# EAGLE design inverter_interface (EAGLE 8.5.1)

## Sheet 1 of 5: power interface
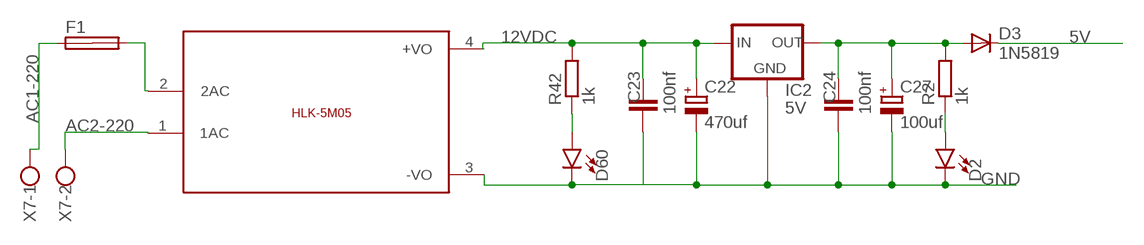
[diagram p0: schematic, sheet 1]

### Parts
C22  470uf  CPOL-EUE3.5-8  [E3,5-8]
C23  100nf  C-EU050-030X075  [C050-030X075]
C24  100nf  C-EU050-030X075  [C050-030X075]
C27  100uf  CPOL-EUE3.5-8  [E3,5-8]
D2  LED5MM  [LED_5MM]
D3  1N5819  1N4004  [DO41-10]
D60  LED5MM  [LED_5MM]
F1  SHK20Q  [SHK20Q]
IC2  5V  V_REG_78XXSIDE  [78XXL]
R2  1k  R-EU_0207/10  [0207/10]
R42  1k  R-EU_0207/10  [0207/10]
U$3  5VDC/5W  HLK-5M05  [HLK-5M05]
X7  W237-102  [W237-102]

### Nets
5V: D3.C ; also sheet 2,3
12VDC: C22.+ C23.2 IC2.IN R42.2 U$3.4(+VO) ; also sheet 4
AC1-220: F1.1A X7.1
AC2-220: U$3.1(1AC) X7.2
GND: C22.- C23.1 C24.1 C27.- D2.K(C) D60.K(C) IC2.GND U$3.3(-VO) ; also sheet 2,3,4,5
N$2: D2.A R2.1
N$5: C24.2 C27.+ D3.A IC2.OUT R2.2
N$6: F1.2A U$3.2(2AC)
N$74: D60.A R42.1
Unconnected: F1.1B F1.2B

## Sheet 2 of 5: MCU
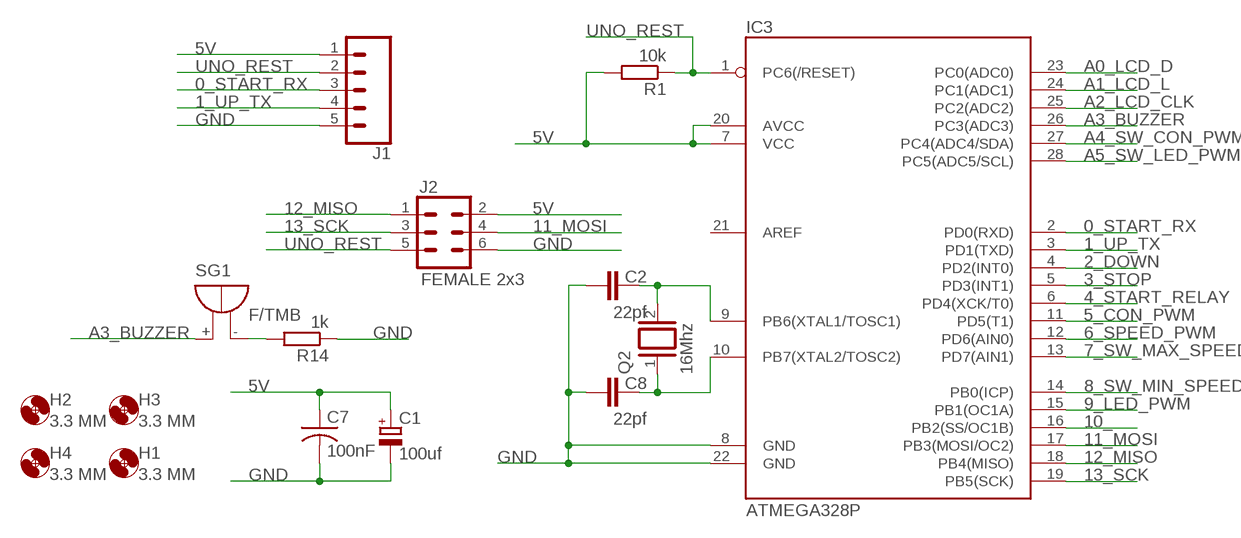
[diagram p1: schematic, sheet 2]

### Parts
C1  100uf  CPOL-EUE3.5-8  [E3,5-8]
C2  22pf  C-EU050-030X075  [C050-030X075]
C7  100nF  C-US050-035X075  [C050-035X075]
C8  22pf  C-EU050-030X075  [C050-030X075]
H1  3.3 MM  MOUNT-HOLE3.3  [3,3]
H2  3.3 MM  MOUNT-HOLE3.3  [3,3]
H3  3.3 MM  MOUNT-HOLE3.3  [3,3]
H4  3.3 MM  MOUNT-HOLE3.3  [3,3]
IC3  ATMEGA328P  ATMEGA328P_PDIP  [DIL-28-3]
J1  CONN_05JST-VERT  [JST-5-PTH-VERT]
J2  FEMALE 2x3  CONN_03X2FEMALE  [2X3]
Q2  16Mhz  XTAL/S  [QS]
R1  10k  R-EU_0207/10  [0207/10]
R14  1k  R-EU_0207/10  [0207/10]
SG1  F/TMB  [F/TMB]

### Nets
0_START_RX: IC3.2(PD0(RXD)) J1.3 ; also sheet 5
1_UP_TX: IC3.3(PD1(TXD)) J1.4 ; also sheet 5
2_DOWN: IC3.4(PD2(INT0)) ; also sheet 5
3_STOP: IC3.5(PD3(INT1)) ; also sheet 5
4_START_RELAY: IC3.6(PD4(XCK/T0)) ; also sheet 4
5_CON_PWM: IC3.11(PD5(T1)) ; also sheet 3
5V: C1.+ C7.1 IC3.7(VCC) IC3.20(AVCC) J1.1 J2.2 R1.2 ; also sheet 1,3
6_SPEED_PWM: IC3.12(PD6(AIN0)) ; also sheet 4
7_SW_MAX_SPEED: IC3.13(PD7(AIN1)) ; also sheet 4
8_SW_MIN_SPEED: IC3.14(PB0(ICP)) ; also sheet 4
9_LED_PWM: IC3.15(PB1(OC1A)) ; also sheet 3
10_: IC3.16(PB2(SS/OC1B))
11_MOSI: IC3.17(PB3(MOSI/OC2)) J2.4
12_MISO: IC3.18(PB4(MISO)) J2.1
13_SCK: IC3.19(PB5(SCK)) J2.3
A0_LCD_D: IC3.23(PC0(ADC0)) ; also sheet 3
A1_LCD_L: IC3.24(PC1(ADC1)) ; also sheet 3
A2_LCD_CLK: IC3.25(PC2(ADC2)) ; also sheet 3
A3_BUZZER: IC3.26(PC3(ADC3)) SG1.+
A4_SW_CON_PWM: IC3.27(PC4(ADC4/SDA)) ; also sheet 3
A5_SW_LED_PWM: IC3.28(PC5(ADC5/SCL)) ; also sheet 3
GND: C1.- C2.1 C7.2 C8.1 IC3.8(GND) IC3.22(GND) J1.5 J2.6 R14.1 ; also sheet 1,3,4,5
N$1: C2.2 IC3.9(PB6(XTAL1/TOSC1)) Q2.2
N$4: C8.2 IC3.10(PB7(XTAL2/TOSC2)) Q2.1
N$62: R14.2 SG1.-
UNO_REST: IC3.1(PC6(/RESET)) J1.2 J2.5 R1.1 ; also sheet 5
Unconnected: IC3.21(AREF)

## Sheet 3 of 5: SPI LCD
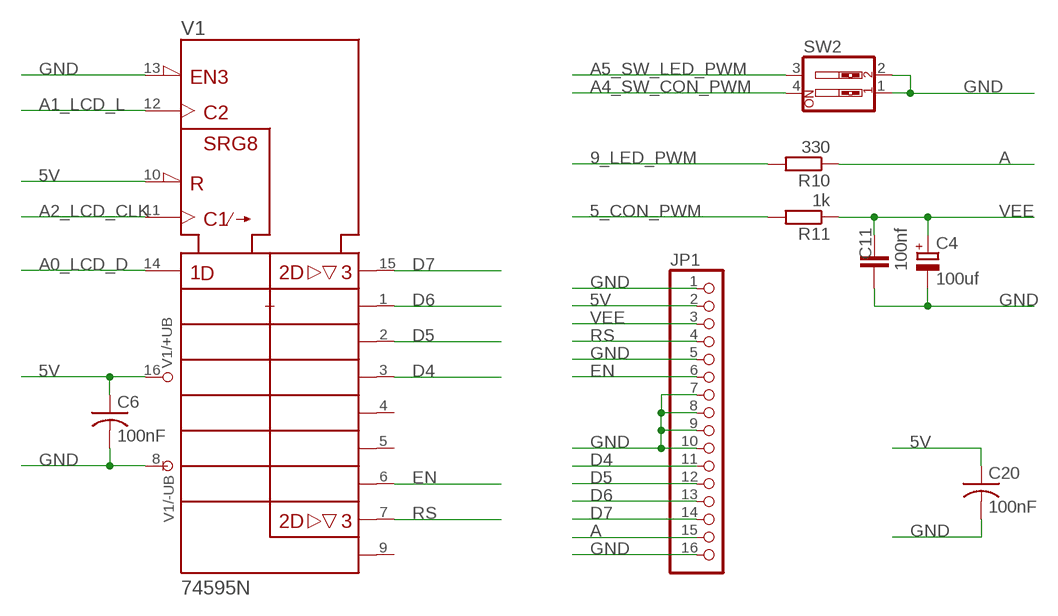
[diagram p2: schematic, sheet 3]

### Parts
C4  100uf  CPOL-EUE3.5-8  [E3,5-8]
C6  100nF  C-US050-035X075  [C050-035X075]
C11  100nf  C-EU050-030X075  [C050-030X075]
C20  100nF  C-US050-035X075  [C050-035X075]
JP1  PINHD-1X16  [1X16]
R10  330  R-EU_0207/10  [0207/10]
R11  1k  R-EU_0207/10  [0207/10]
SW2  SW_DIP-2  [DIPSWITCH-02]
V1  74595N  [DIL16]

### Nets
5_CON_PWM: R11.2 ; also sheet 2
5V: C6.1 C20.1 JP1.2 V1.10(!SRCLR) V1.16(+UB) ; also sheet 1,2
9_LED_PWM: R10.2 ; also sheet 2
A: JP1.15 R10.1
A0_LCD_D: V1.14(SER) ; also sheet 2
A1_LCD_L: V1.12(RCK) ; also sheet 2
A2_LCD_CLK: V1.11(SRCK) ; also sheet 2
A4_SW_CON_PWM: SW2.4 ; also sheet 2
A5_SW_LED_PWM: SW2.3 ; also sheet 2
D4: JP1.11 V1.3(QD)
D5: JP1.12 V1.2(QC)
D6: JP1.13 V1.1(QB)
D7: JP1.14 V1.15(QA)
EN: JP1.6 V1.6(QG)
GND: C4.- C6.2 C11.1 C20.2 JP1.1 JP1.5 JP1.7 JP1.8 JP1.9 JP1.10 JP1.16 SW2.1 SW2.2 V1.8(-UB) V1.13(!G) ; also sheet 1,2,4,5
RS: JP1.4 V1.7(QH)
VEE: C4.+ C11.2 JP1.3 R11.1
Unconnected: V1.4(QE) V1.5(QF) V1.9(QH*)

## Sheet 4 of 5: 0-10 v
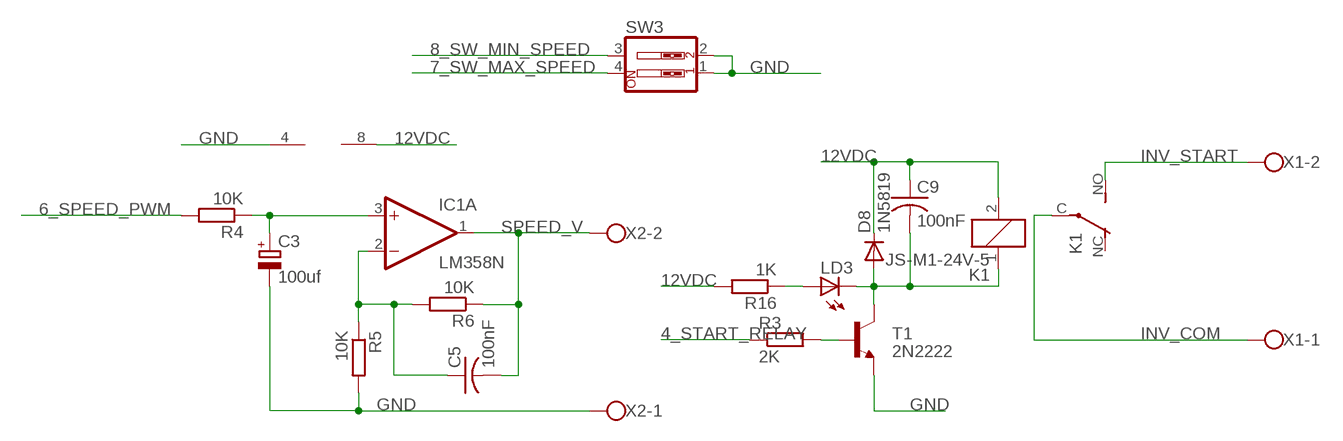
[diagram p3: schematic, sheet 4]

### Parts
C3  100uf  CPOL-EUE3.5-8  [E3,5-8]
C5  100nF  C-US050-035X075  [C050-035X075]
C9  100nF  C-US050-035X075  [C050-035X075]
D8  1N5819  1N4004  [DO41-10]
IC1  LM358N  [DIL08]
K1  JS-M1-24V-5  JS-M1-12V-5  [JS-M]
LD3  LED5MM  [LED5MM]
R3  2K  R-EU_0207/10  [0207/10]
R4  10K  R-EU_0207/10  [0207/10]
R5  10K  R-EU_0207/10  [0207/10]
R6  10K  R-EU_0207/10  [0207/10]
R16  1K  R-EU_0207/10  [0207/10]
SW3  SW_DIP-2  [DIPSWITCH-02]
T1  2N2222  [TO92-EBC-OVAL]
X1  W237-102  [W237-102]
X2  W237-102  [W237-102]

### Nets
4_START_RELAY: R3.1 ; also sheet 2
6_SPEED_PWM: R4.2 ; also sheet 2
7_SW_MAX_SPEED: SW3.4 ; also sheet 2
8_SW_MIN_SPEED: SW3.3 ; also sheet 2
12VDC: C9.1 D8.C IC1.8(P:V+) K1.2 R16.2 ; also sheet 1
GND: C3.- IC1.4(P:V-) R5.2 SW3.1 SW3.2 T1.E X2.1 ; also sheet 1,2,3,5
INV_COM: K1.C(2:P) X1.1
INV_START: K1.NO(2:S) X1.2
N$3: C3.+ IC1.3(A:+IN) R4.1
N$7: C5.1 IC1.2(A:-IN) R5.1 R6.2
N$11: C9.2 D8.A K1.1 LD3.K(C) T1.C
N$12: R3.2 T1.B
N$14: LD3.A R16.1
SPEED_V: C5.2 IC1.1(A:OUT) R6.1 X2.2
Unconnected: IC1.5(B:+IN) IC1.6(B:-IN) IC1.7(B:OUT) K1.NC(2:O)

## Sheet 5 of 5: Buttons
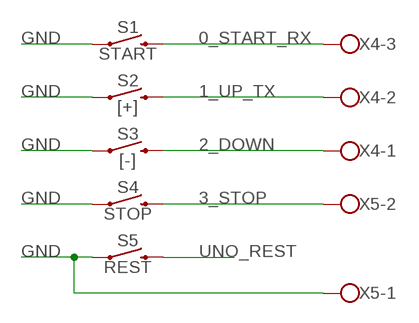
[diagram p4: schematic, sheet 5]

### Parts
S1  START  MOMENTARY-SWITCH-SPST-PTH-6.0MM  [TACTILE_SWITCH_PTH_6.0MM]
S2  [+]  MOMENTARY-SWITCH-SPST-PTH-6.0MM  [TACTILE_SWITCH_PTH_6.0MM]
S3  [-]  MOMENTARY-SWITCH-SPST-PTH-6.0MM  [TACTILE_SWITCH_PTH_6.0MM]
S4  STOP  MOMENTARY-SWITCH-SPST-PTH-6.0MM  [TACTILE_SWITCH_PTH_6.0MM]
S5  REST  MOMENTARY-SWITCH-SPST-PTH-6.0MM  [TACTILE_SWITCH_PTH_6.0MM]
X4  W237-103  [W237-103]
X5  W237-102  [W237-102]

### Nets
0_START_RX: S1.3 X4.3 ; also sheet 2
1_UP_TX: S2.3 X4.2 ; also sheet 2
2_DOWN: S3.3 X4.1 ; also sheet 2
3_STOP: S4.3 X5.2 ; also sheet 2
GND: S1.1 S2.1 S3.1 S4.1 S5.1 X5.1 ; also sheet 1,2,3,4
UNO_REST: S5.3 ; also sheet 2

## Library data of the parts
C1 C3 C4 C22 C27 = rcl:CPOL-EU: POLARIZED CAPACITOR, European symbol
C2 C8 C11 C23 C24 = rcl:C-EU: CAPACITOR, European symbol
C5-C7 C9 C20 = rcl:C-US: CAPACITOR, American symbol; SPICEPREFIX: C
D2 D60 = SparkFun-LED:LED: LED (Generic) Standard schematic elements and footprints for 5mm, 3mm, 1206, and 0603 sized LEDs. Generic LEDs with no color specified.
D3 D8 = adafruit:1N4004: DIODE General purpose 1N400x type rectifier (With bigger pads) http://www.ladyada.net/library/pcb/eaglelibrary.html
F1 = fuse:SHK20Q: FUSE HOLDER 5 x 20 mm, SH contact, E1207 Buerklin 64G6061
H1-H4 = holes:MOUNT-HOLE: MOUNTING HOLE with drill center marker
IC1 = linear:LM358: OP AMP also LM158; LM258; LM2904 Source: http://cache.national.com/ds/LM/LM158.pdf
IC2 = SparkFun:V_REG_78XX: Voltage Regulator Standard 7805 5V regulator. IGO (Input Ground Output). Spark Fun Electronics SKU : COM-00107
IC3 = FaBo-MPU:ATMEGA328P_PDIP
J1 = SparkFun-Connectors:CONN_05: Multi connection point. Often used as Generic Header-pin footprint for 0.1 inch spaced/style header connections On any of the 0.1 inch spaced packages, you can populate with these: Break Away Headers - Straight <https://www.sparkfun.com/products/116> (PRT-00116) Break Away Male Headers - Right Angle <https://www.sparkfun.com/products/553> (PRT-00553) Female Headers <https://www.sparkfun.com/products/115> (PRT-00115) Break Away Headers - Machine Pin <https://www.sparkfun.com/products/117> (PRT-00117) Break Away Female Headers - Swiss Machine Pin <https://www.sparkfun.com/products/743> (PRT-00743) For SCREWTERMINALS and SPRING TERMINALS visit here: Screw Terimnals on SparkFun.com <https://www.sparkfun.com/search/results?term=Screw+Terminals> (5mm/3.5mm/2.54mm spacing) This device is also useful as a general connection point to wire up your design to another part of your project. Our various solder wires solder well into these plated through hole pads. Hook-Up Wire - Assortment (Stranded, 22 AWG) <https://www.sparkfun.com/products/11375> (PRT-11375) Hook-Up Wire - Assortment (Solid Core, 22 AWG) <https://www.sparkfun.com/products/11367> (PRT-11367) View the entire wire category on our website here <https://www.sparkfun.com/categories/141> Special notes: Molex polarized connector foot print use with SKU : PRT-08231 with associated crimp pins and housings. 1MM SMD Version SKU: PRT-10208
J2 = SparkFun-Connectors:CONN_03X2: Multi connection point. Often used as Generic Header-pin footprint for 0.1 inch spaced/style header connections You can populate with any combo of single row headers, but if you'd like an exact match, check these: Header - 2x3 (Male, 0.1") <https://www.sparkfun.com/products/12807> (PRT-12807) Header - 2x3 (Female, 0.1") <https://www.sparkfun.com/products/13010> (PRT-13010) 2x3 Pin Shrouded Header <https://www.sparkfun.com/products/10877> (PRT-10877) On any of the 0.1 inch spaced packages, you can populate with these: Break Away Headers - Straight <https://www.sparkfun.com/products/116> (PRT-00116) Break Away Male Headers - Right Angle <https://www.sparkfun.com/products/553> (PRT-00553) Female Headers <https://www.sparkfun.com/products/115> (PRT-00115) Break Away Headers - Machine Pin <https://www.sparkfun.com/products/117> (PRT-00117) Break Away Female Headers - Swiss Machine Pin <https://www.sparkfun.com/products/743> (PRT-00743) Special note: the shrouded connector mates well with our 3x2 ribbon cables: Ribbon Crimp Connector - 6-pin (2x3, Female) <https://www.sparkfun.com/products/10651> (PRT-10651) Ribbon Cable - 6 wire (15ft) <https://www.sparkfun.com/products/10646> (PRT-10646); PROD_ID: CONN-11566
JP1 = pinhead:PINHD-1X16: PIN HEADER
K1 = relay:JS-M1*: Automotive Ultra-Miniature Power Relay NAiS Source: http://www.mew-europe.com/.. en_ds_61211_0000.pdf; MF: FARNELL; MPN: JSM1-12V-5; OC_FARNELL: 910351; OC_NEWARK: 14J1764
LD3 = led:LED: LED OSRAM: - CHIPLED LG R971, LG N971, LY N971, LG Q971, LY Q971, LO R971, LY R971 LH N974, LH R974 LS Q976, LO Q976, LY Q976 LO Q996 - Hyper CHIPLED LW Q18S LB Q993, LB Q99A, LB R99A - SideLED LS A670, LO A670, LY A670, LG A670, LP A670 LB A673, LV A673, LT A673, LW A673 LH A674 LY A675 LS A676, LA A676, LO A676, LY A676, LW A676 LS A679, LY A679, LG A679 - Hyper Micro SIDELED® LS Y876, LA Y876, LO Y876, LY Y876 LT Y87S - SmartLED LW L88C, LW L88S LB L89C, LB L89S, LG L890 LS L89K, LO L89K, LY L89K LS L896, LA L896, LO L896, LY L896 - TOPLED LS T670, LO T670, LY T670, LG T670, LP T670 LSG T670, LSP T670, LSY T670, LOP T670, LYG T670 LG T671, LOG T671, LSG T671 LB T673, LV T673, LT T673, LW T673 LH T674 LS T676, LA T676, LO T676, LY T676, LB T676, LH T676, LSB T676, LW T676 LB T67C, LV T67C, LT T67C, LS T67K, LO T67K, LY T67K, LW E67C LS E67B, LA E67B, LO E67B, LY E67B, LB E67C, LV E67C, LT E67C LW T67C LS T679, LY T679, LG T679 LS T770, LO T770, LY T770, LG T770, LP T770 LB T773, LV T773, LT T773, LW T773 LH T774 LS E675, LA E675, LY E675, LS T675 LS T776, LA T776, LO T776, LY T776, LB T776 LHGB T686 LT T68C, LB T68C - Hyper Mini TOPLED® LB M676 - Mini TOPLED Santana® LG M470 LS M47K, LO M47K, LY M47K Source: http://www.osram.convergy.de/
Q2 = special:XTAL/S: CRYSTAL
R1 R2 R10 R11 R14 R42 = rcl:R-EU_: RESISTOR, European symbol
R3-R6 R16 = rcl-2:R-EU_: RESISTOR, European symbol
S1-S5 = SparkFun-Switches:MOMENTARY-SWITCH-SPST: Momentary Switch (Pushbutton) - SPST Normally-open (NO) SPST momentary switches (buttons, pushbuttons). Variants PTH-12MM - 12mm square, through-hole Momentary Pushbutton Switch - 12mm Square <https://www.sparkfun.com/products/9190> (COM-09190) PTH-6.0MM, PTH-6.0MM-KIT - 6.0mm square, through-hole Mini Pushbutton Switch <https://www.sparkfun.com/products/97> (COM-00097) KIT package intended for soldering kit's - only one side of pads' copper is exposed. PTH-RIGHT-ANGLE-KIT - Right-angle, through-hole Right Angle Tactile Button <https://www.sparkfun.com/products/10791> - Used on SparkFun BigTime Watch Kit <https://www.sparkfun.com/products/11734> SMD-12MM - 12mm square, surface-mount Tactile Button - SMD (12mm) <https://www.sparkfun.com/products/12993> (COM-12993) Used on SparkFun PicoBoard <https://www.sparkfun.com/products/11888> SMD-4.5MM - 4.5mm Square Trackball Switch Used on SparkFun Blackberry Trackballer Breakout <https://www.sparkfun.com/products/13169> SMD-4.6MMX2.8MM - 4.60mm x 2.80mm, surface mount Used on SparkFun SAMD21 Mini Breakout <https://www.sparkfun.com/products/13664> SMD-5.2MM, SMD-5.2-REDUNDANT - 5.2mm square, surface-mount Mini Pushbutton Switch - SMD <https://www.sparkfun.com/products/8720> (COM-08720) Used on Arduino Pro Mini <https://www.sparkfun.com/products/11114> REDUNDANT package connects both switch circuits together SMD-6.0X3.5MM - 6.0 x 3.5mm, surface mount Momentary Reset Switch SMD <https://www.sparkfun.com/products/8229> (COM-08229) SMD-6.2MM-TALL - 6.2mm square, surface mount Tactile Button - SMD (6mm) <https://www.sparkfun.com/products/12992> Used on SparkFun Digital Sandbox <https://www.sparkfun.com/products/12651> SMD-RIGHT-ANGLE - Right-angle, surface mount Used on SparkFun Block for Intel® Edison - Arduino <https://www.sparkfun.com/products/13036>; PROD_ID: SWCH-08441; SF_SKU: COM-00097
SG1 = buzzer:F/TMB: BUZZER Source: Buerklin; OC_FARNELL: unknown; OC_NEWARK: unknown
SW2 SW3 = SparkFun:SW_DIP-2: DIP SWITCH
T1 = adafruit:2N2222: NPN TRANSISTOR Big oval pads
U$3 = HLK-5M05:HLK-5M05: HLK-5M05 is an 5Volt/5W smps developed by HI-LINK; SIZE: 23x38(mm)
V1 = 74ttl-din:74*595: 8-bit SHIFT REGISTER, output latch
X1 X2 X5 = con-wago-500:W237-102: WAGO SCREW CLAMP; MPN: 237-102; OC_FARNELL: unknown; OC_NEWARK: 70K9898
X4 = con-wago-500:W237-103: WAGO SCREW CLAMP; MPN: 237-103; OC_FARNELL: unknown; OC_NEWARK: 18M7116
X7 = con-wago-500:W237-102: WAGO SCREW CLAMP

## Board
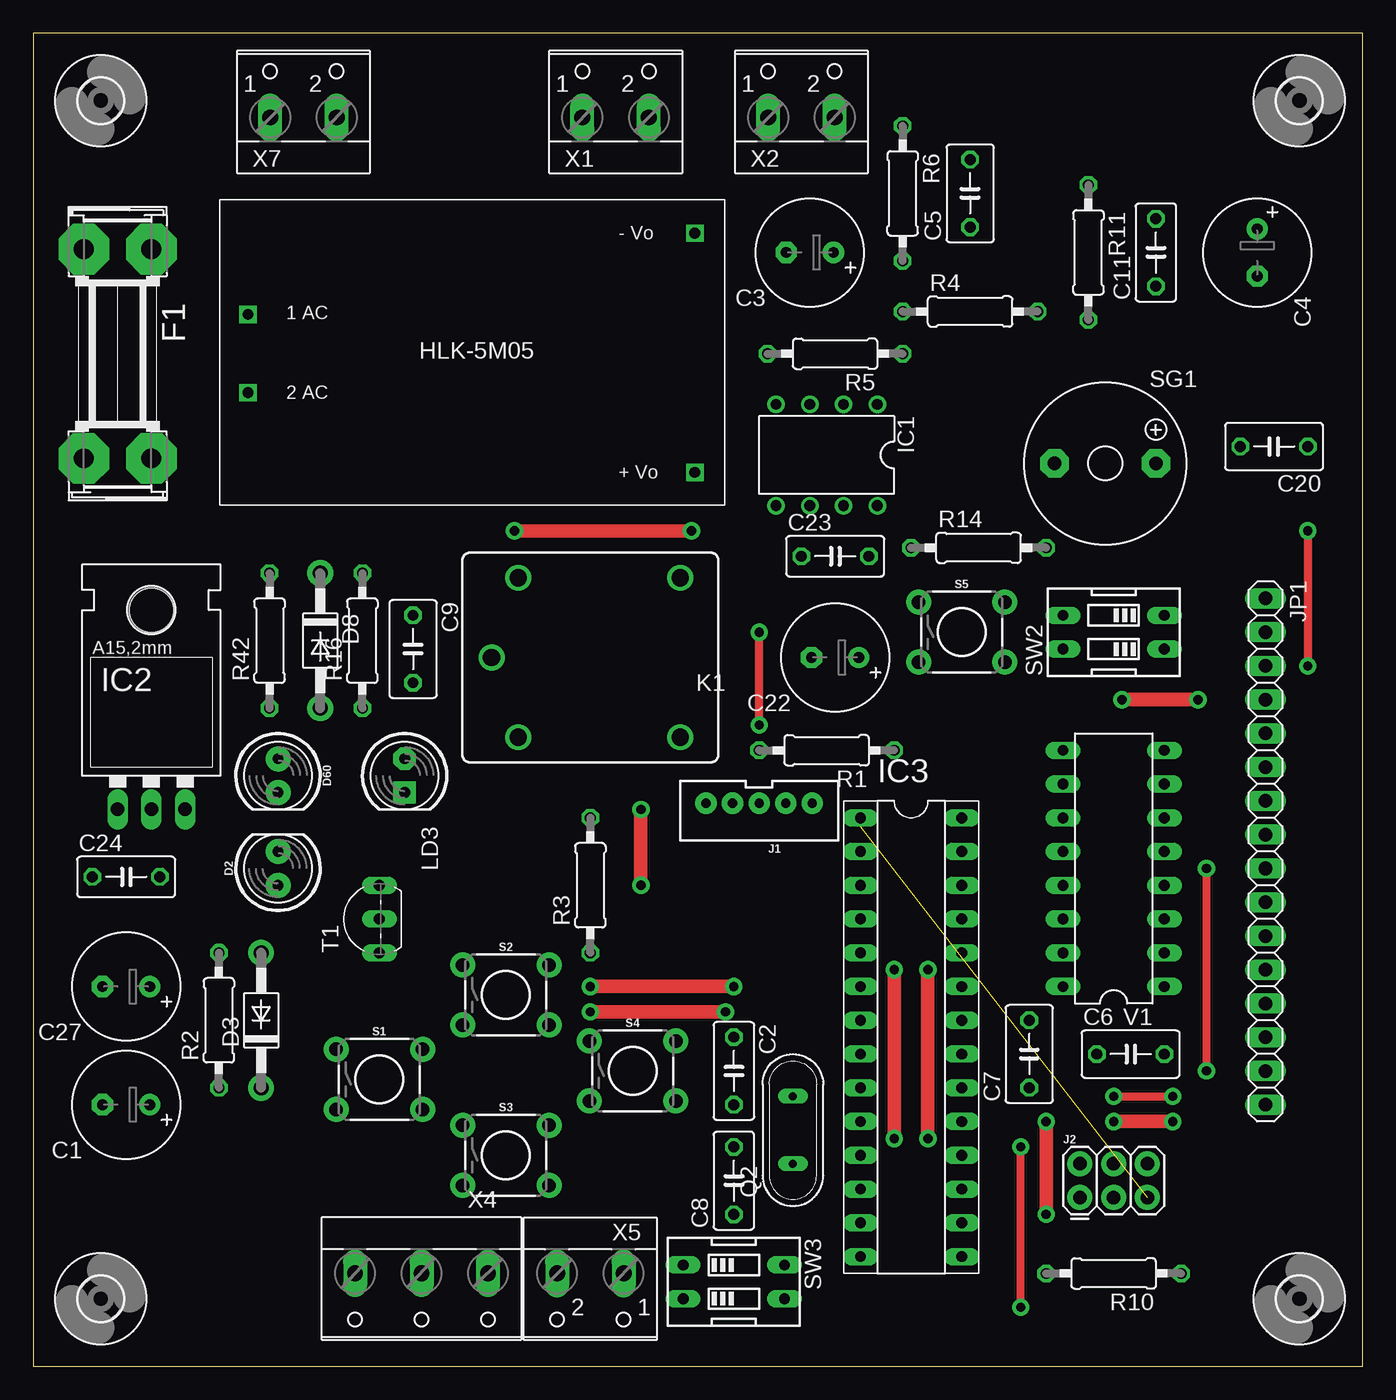
[diagram p5: board, top side]
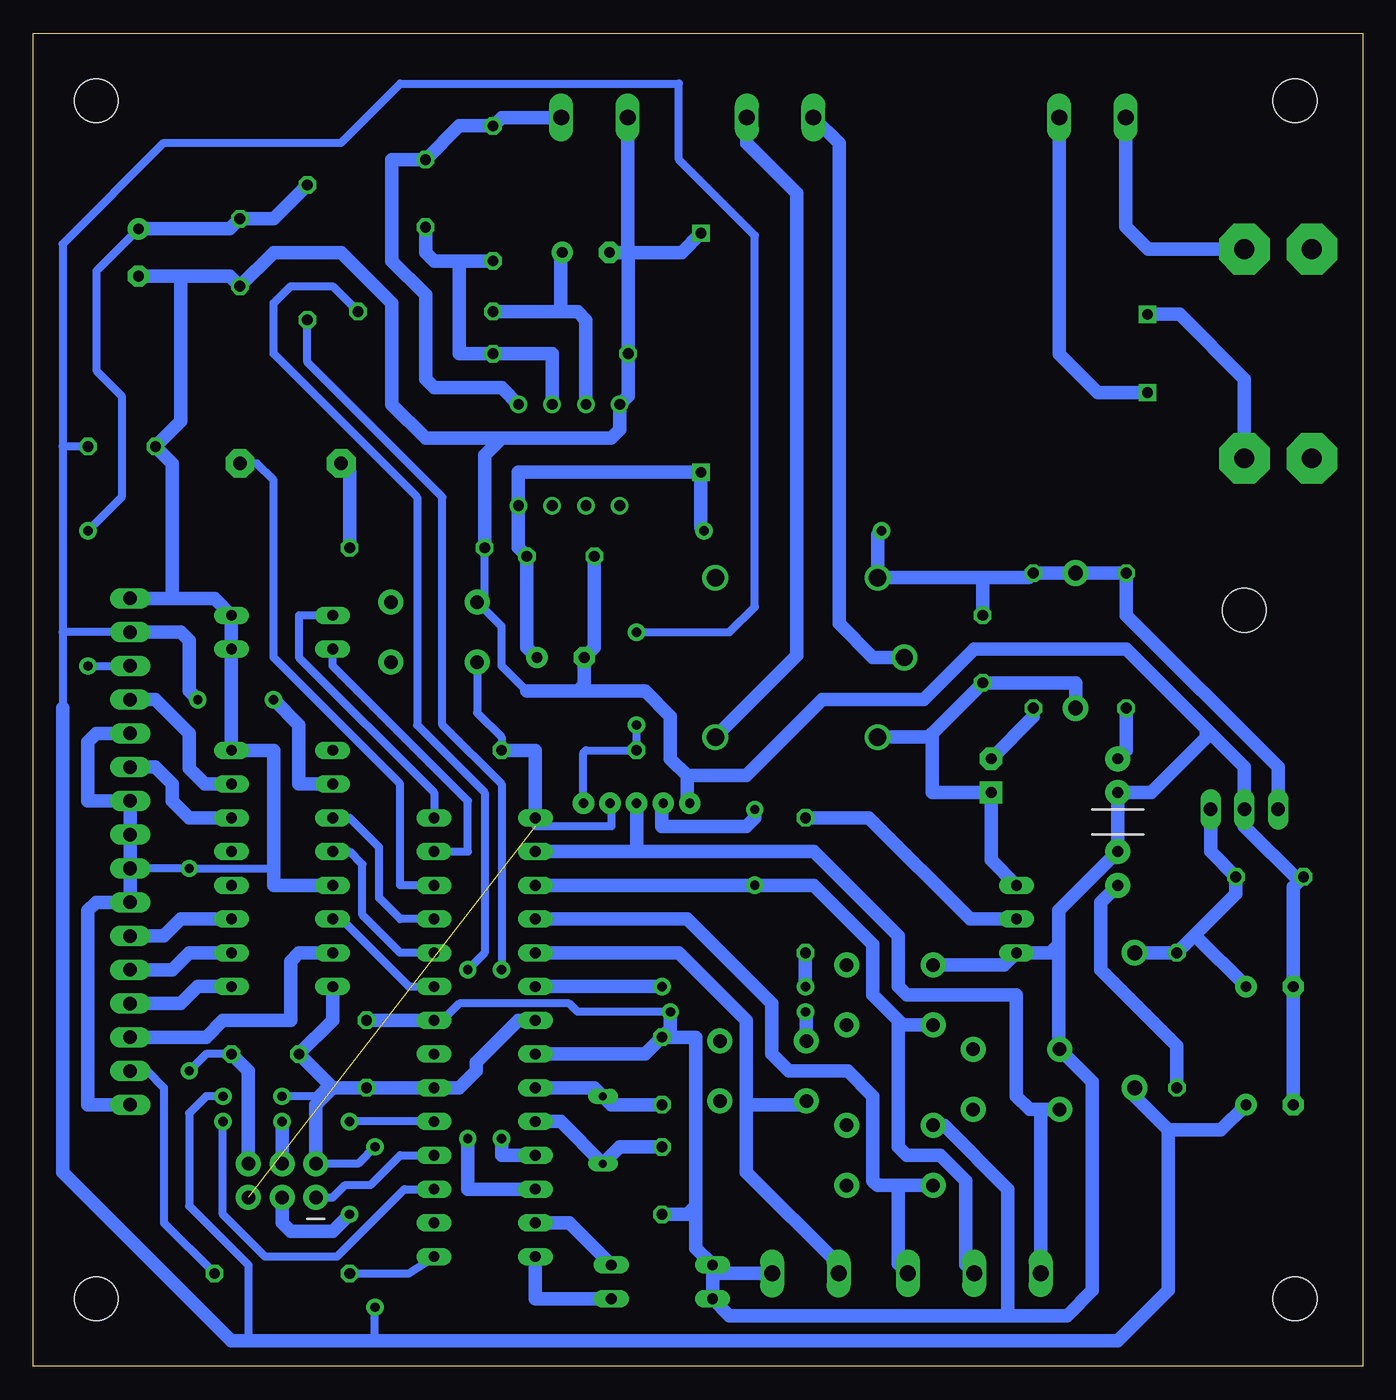
[diagram p6: board, bottom side, seen from below]

Size 100 x 100.32 mm. Coordinates in mm from the lower left corner, seen from the top.
Outline: 0,0 100,0 100,100.32 0,100.32 0,0
Copper layers (1*16): Top 0.035mm / dielectric 1.5mm / Bottom 0.035mm
Design rules "default": minimum track width 6mil, minimum drill 0.35mm, track to track 6mil, track to pad 6mil, pad to pad 6mil, via to via 6mil, smd to smd 6mil, copper to edge 40mil, drill to drill 6mil, minimum pad ring 10mil, minimum via ring 8mil, stop-mask expansion 4mil, vias tented up to drill 0mil, thermal gap 10mil

### Footprints (pad centres in the part's own frame; a part is rotated, then mirrored left to right if it is on the bottom)
E3,5-8 = drill 0.813 pad 1.6: + -1.778,0 | drill 0.813 pad 1.6 octagon: - 1.778,0
C050-030X075 = drill 0.813 octagon: 1 -2.54,0; 2 2.54,0
C050-035X075 = drill 0.813 octagon: 1 -2.54,0; 2 2.54,0
LED_5MM = drill 0.813 pad 1.88: A -1.27,0; K 1.27,0
DO41-10 = drill 1.118 pad 1.93: A 5.08,0; C -5.08,0
SHK20Q = drill 1.5 pad 3.81 octagon: 1A -7.874,2.54; 1B -7.874,-2.54; 2A 7.874,2.54; 2B 7.874,-2.54
3,3 = hole 3.3: 0,0
DIL08 = drill 0.813 pad 1.27: 1 -3.81,-3.81; 2 -1.27,-3.81; 3 1.27,-3.81; 4 3.81,-3.81; 5 3.81,3.81; 6 1.27,3.81; 7 -1.27,3.81; 8 -3.81,3.81
78XXL = drill 1.016 long: GND 0,-3.81; IN -2.54,-3.81; OUT 2.54,-3.81 | hole 3.302: 0,11.176
DIL-28-3 = drill 0.813 long: 1 -15.24,-3.81; 2 -12.7,-3.81; 3 -10.16,-3.81; 4 -7.62,-3.81; 5 -5.08,-3.81; 6 -2.54,-3.81; 7 0,-3.81; 8 2.54,-3.81; 9 5.08,-3.81; 10 7.62,-3.81; 11 10.16,-3.81; 12 12.7,-3.81; 13 15.24,-3.81; 14 17.78,-3.81; 15 17.78,3.81; 16 15.24,3.81; 17 12.7,3.81; 18 10.16,3.81; 19 7.62,3.81; 20 5.08,3.81; 21 2.54,3.81; 22 0,3.81; 23 -2.54,3.81; 24 -5.08,3.81; 25 -7.62,3.81; 26 -10.16,3.81; 27 -12.7,3.81; 28 -15.24,3.81
JST-5-PTH-VERT = drill 0.7 pad 1.6: 1 -4,0.18; 2 -2,0.18; 3 0,0.18; 4 2,0.18; 5 4,0.18
2X3 = drill 1.016 pad 1.88: 1 0,0; 2 0,2.54; 3 2.54,0; 4 2.54,2.54; 5 5.08,0; 6 5.08,2.54
1X16 = drill 1.016 long: 1 -19.05,0; 2 -16.51,0; 3 -13.97,0; 4 -11.43,0; 5 -8.89,0; 6 -6.35,0; 7 -3.81,0; 8 -1.27,0; 9 1.27,0; 10 3.81,0; 11 6.35,0; 12 8.89,0; 13 11.43,0; 14 13.97,0; 15 16.51,0; 16 19.05,0
JS-M = drill 1.3: 1 6.7,6; 2 6.7,-6; C 8.7,0; NC -5.5,-6; NO -5.5,6
LED5MM = drill 0.813 pad 1.676 octagon: A -1.27,0 | drill 0.813 pad 1.676 square: K 1.27,0
QS = drill 0.61 long: 1 -2.54,0; 2 2.54,0
0207/10 = drill 0.813 octagon: 1 -5.08,0; 2 5.08,0
TACTILE_SWITCH_PTH_6.0MM = drill 1.016 pad 1.88: 1 -3.251,2.261; 2 3.251,2.261; 3 -3.251,-2.261; 4 3.251,-2.261
F/TMB = drill 1.016 pad 2.159 octagon: + 3.81,0; - -3.81,0
DIPSWITCH-02 = drill 0.813 long: 1 -1.27,-3.81; 2 1.27,-3.81; 3 1.27,3.81; 4 -1.27,3.81
TO92-EBC-OVAL = drill 0.813 long: B 0,-1.27; C 2.54,-1.27; E -2.54,-1.27
HLK-5M05 = drill 0.8 square: 1 -16.85,-2.93; 2 -16.85,2.97; 3 16.75,9.07; 4 16.75,-8.93
DIL16 = drill 0.813 long: 1 -8.89,-3.81; 2 -6.35,-3.81; 3 -3.81,-3.81; 4 -1.27,-3.81; 5 1.27,-3.81; 6 3.81,-3.81; 7 6.35,-3.81; 8 8.89,-3.81; 9 8.89,3.81; 10 6.35,3.81; 11 3.81,3.81; 12 1.27,3.81; 13 -1.27,3.81; 14 -3.81,3.81; 15 -6.35,3.81; 16 -8.89,3.81
W237-102 = drill 1.194 long: 1 -2.5,-1.27; 2 2.5,-1.27
W237-103 = drill 1.194 long: 1 -5,-1.29; 2 0,-1.29; 3 5,-1.29

### Placement (x,y rotation side)
C1  6.99,19.68 180 top
C2  52.7,22.23 270 top
C3  58.42,83.82 180 top
C4  92.08,83.82 270 top
C5  70.48,88.27 90 top
C6  82.55,23.5 0 top
C7  74.93,23.5 90 top
C8  52.7,13.97 90 top
C9  28.57,53.98 270 top
C11  84.45,83.82 90 top
C20  93.34,69.22 180 top
C22  60.33,53.34 180 top
C23  60.33,60.96 0 top
C24  6.99,36.83 0 top
C27  6.99,28.57 180 top
D2  18.41,37.47 90 top
D3  17.14,26.04 90 top
D8  21.59,54.61 270 top
D60  18.41,44.45 270 top
F1  6.35,76.2 270 top
H1  5.08,95.25 0 top
H2  5.08,5.08 0 top
H3  95.25,95.25 0 top
H4  95.25,5.08 0 top
IC1  59.69,68.58 180 top
IC2  8.89,45.72 0 top
IC3  66.04,26.04 270 top
J1  54.61,42.55 180 top
J2  78.74,12.7 0 top
JP1  92.71,38.73 270 top
K1  43.18,53.34 180 top
LD3  27.94,44.45 270 top
Q2  57.15,17.78 90 top
R1  59.69,46.35 180 top
R2  13.97,26.04 90 top
R3  41.91,36.2 90 top
R4  70.48,79.38 0 top
R5  60.33,76.2 180 top
R6  65.41,88.27 270 top
R10  81.28,6.99 180 top
R11  79.38,83.82 270 top
R14  71.12,61.59 0 top
R16  24.77,54.61 90 top
R42  17.78,54.61 90 top
S1  26.04,21.59 0 top
S2  35.56,27.94 0 top
S3  35.56,15.88 0 top
S4  45.09,22.23 0 top
S5  69.85,55.24 0 top
SG1  80.64,67.94 0 top
SW2  81.28,55.24 90 top
SW3  52.7,6.35 270 top
T1  24.77,33.66 90 top
U$3  33.02,76.2 0 top
V1  81.28,37.47 90 top
X1  43.81,95.25 0 top
X2  57.78,95.25 0 top
X4  29.21,5.71 180 top
X5  41.91,5.71 180 top
X7  20.32,95.25 0 top

### Tracks (layer width: path | path; a pad name or v marks a point on that pad's centre or on a via)
0_START_RX
  Bottom 1.016: IC3.2 54.61,38.73 | S1.3 24.13,19.33 | 24.13,19.33 25.04,19.33 26.04,20.32 26.04,27.94 34.29,27.94 34.92,28.57 34.92,32.38 41.27,38.73 54.61,38.73 | X4.3 24.21,19.25 24.13,19.33 | J1.3 54.61,38.73
1_UP_TX  (via drill 0.7 pad 1.3)
  Top 1.016: v45.72,36.2 v45.72,41.91
  Bottom 1.016: 34.92,26.04 34.92,16.51 34.29,15.88 31.75,15.88 29.84,13.97 29.84,7.64 X4.2 | S2.3 34.57,25.68 34.92,26.04 | J1.4 52.7,42.27 52.7,40.64 46.35,40.64 45.72,41.27 v45.72,41.91 | 34.92,26.04 36.83,27.94 36.83,31.75 41.27,36.2 v45.72,36.2 IC3.3
2_DOWN
  Bottom 1.016: IC3.4 50.8,33.66 44.45,27.3 44.45,23.5 43.18,22.23 38.73,22.23 36.83,20.32 36.83,13.97 36.47,13.61 34.92,13.61 | S3.3 34.92,13.61 | 34.92,13.61 34.92,7.72 X4.1
3_STOP
  Bottom 1.016: IC3.5 51.44,31.11 46.35,26.04 46.35,19.68 | 46.35,19.68 41.91,19.68 41.91,19.89 S4.3 | X5.2 39.41,7.66 46.35,14.61 46.35,19.68
4_START_RELAY  (via drill 0.7 pad 1.3)
  Top 1.016: v52.7,28.57 v41.91,28.57
  Bottom 1.016: IC3.6 v52.7,28.57 | v41.91,28.57 R3.1
5_CON_PWM  (via drill 0.7 pad 1.3)
  Top 1.016: v64.77,17.14 v64.77,29.84
  Bottom 0.61: R11.2 79.38,75.56 69.22,65.41 69.22,48.26 64.77,43.81 v64.77,29.84
  Bottom 1.016: IC3.11 64.77,15.88 v64.77,17.14
5V  (via drill 0.7 pad 1.3)
  Top 0.61: v54.61,48.26 v54.61,55.24 | v74.3,4.45 v74.3,16.51 | v81.28,20.32 v85.72,20.32
  Top 1.016: v87.63,50.16 v81.92,50.16
  Bottom 0.61: J1.1 58.61,46.16 58.42,46.35 R1.2 v54.61,48.26 | v54.61,55.24 47.62,55.24 45.72,57.15 45.72,85.09 51.44,90.81 51.44,96.52 72.39,96.52 76.83,92.08 90.17,92.08 97.79,84.45 97.79,69.22 | 74.3,1.91 v74.3,4.45 | v74.3,16.51 75.56,15.24 J2.2 | 77.79,21.27 78.74,20.32 v81.28,20.32 | v85.72,20.32 87,20.32 88.27,19.05 88.27,12.06 83.82,7.62 83.82,1.91 | 97.79,69.22 97.79,55.24 | 97.79,55.24 97.79,49.53 | JP1.2 97.79,55.24 | C20.1 97.79,69.22
  Bottom 1.016: C1.+ 10.67,17.78 14.61,17.78 | 14.61,17.78 17.14,20.32 D3.C | JP1.2 88.9,55.24 88.27,54.61 88.27,50.8 v87.63,50.16 | v81.92,50.16 80.01,48.26 80.01,43.81 V1.10 | IC3.7 63.5,26.04 66.67,22.86 66.67,22.23 67.94,20.95 IC3.20 C7.1 77.47,20.95 | 14.61,17.78 14.61,5.71 18.41,1.91 74.3,1.91 83.82,1.91 85.09,1.91 97.79,14.61 97.79,49.53 | 77.47,20.95 77.79,21.27 C6.1 77.47,26.04 V1.16 | J2.2 78.74,19.68 77.47,20.95
6_SPEED_PWM  (via drill 0.7 pad 1.3)
  Top 1.016: v67.31,17.14 v67.31,29.84
  Bottom 0.61: R4.2 77.47,81.28 80.64,81.28 81.92,80.01 81.92,76.2 71.12,65.41 71.12,48.26 66.04,43.18 66.04,31.11 v67.31,29.84
  Bottom 1.016: IC3.12 67.31,13.34 v67.31,17.14
7_SW_MAX_SPEED
  Bottom 1.016: IC3.13 59.69,10.79 SW3.4
8_SW_MIN_SPEED
  Bottom 1.016: IC3.14 62.23,5.08 SW3.3
9_LED_PWM
  Bottom 0.61: R10.2 71.75,6.99 IC3.15
11_MOSI  (via drill 0.7 pad 1.3)
  Top 1.016: v81.28,18.41 v85.72,18.41
  Bottom 0.61: IC3.17 72.07,13.34 77.15,8.26 82.55,8.26 85.72,11.43 v85.72,18.41
  Bottom 1.016: J2.4 v81.28,18.41
12_MISO
  Bottom 0.61: J2.1 77.47,12.7 76.52,13.65 74.61,13.65 72.39,15.88 IC3.18
12VDC  (via drill 0.7 pad 1.3)
  Top 1.016: v49.53,62.87 v36.2,62.87
  Bottom 1.016: v49.53,62.87 49.77,63.1 U$3.4 49.81,67.31 63.5,67.31 IC1.8 63.5,61.59 C23.2 62.87,54.1 C22.+ | v36.2,62.87 36.48,62.58 K1.2 28.57,59.34 | IC2.IN 6.35,45.09 17.78,56.52 R42.2 D8.C R16.2 25.11,59.34 28.57,59.34 | C9.1 28.57,59.34
13_SCK  (via drill 0.7 pad 1.3)
  Top 1.016: v76.2,11.43 v76.2,18.41
  Bottom 0.61: IC3.19 v76.2,18.41
  Bottom 1.016: J2.3 81.28,10.79 80.64,10.16 77.47,10.16 v76.2,11.43
A
  Bottom 0.61: R10.1 90.17,10.79 90.17,20.95 91.44,22.23 JP1.15
A0_LCD_D
  Bottom 0.61: V1.14 76.83,33.66 71.75,28.57 IC3.23
A1_LCD_L
  Bottom 0.61: IC3.24 72.39,31.11 75.25,33.97 75.25,37.78 76.2,38.73 V1.12
A2_LCD_CLK
  Bottom 0.61: IC3.25 72.39,33.66 73.98,35.24 73.98,39.05 76.2,41.27 V1.11
A3_BUZZER
  Bottom 0.61: IC3.26 72.39,36.2 72.39,43.81 81.92,53.34 81.92,66.67 83.19,67.94 SG1.+
A4_SW_CON_PWM
  Bottom 0.61: IC3.27 67.31,38.73 67.31,42.55 77.47,52.7 SW2.4
A5_SW_LED_PWM
  Bottom 0.61: SW2.3 80.01,56.52 80.01,53.34 69.85,43.18 IC3.28
AC1-220
  Bottom 1.016: X7.1 17.82,85.77 16.13,84.07 F1.1A
AC2-220
  Bottom 1.016: U$3.1 19.93,73.27 22.82,76.16 X7.2
D4
  Bottom 1.016: JP1.11 90.17,32.38 88.9,33.66 V1.3
D5
  Bottom 1.016: V1.2 88.27,31.11 89.53,29.84 JP1.12
D6
  Bottom 1.016: V1.1 87.63,28.57 88.9,27.3 JP1.13
D7
  Bottom 1.016: V1.15 80.01,31.11 80.64,30.48 80.64,26.04 85.72,26.04 87,24.77 JP1.14
EN
  Bottom 1.016: V1.6 88.27,41.27 89.53,42.55 89.53,43.81 90.81,45.09 JP1.6
GND  (via drill 0.7 pad 1.3)
  Top 0.61: v88.27,22.23 v88.27,37.47
  Top 1.016: v41.91,26.67 v52.07,26.67
  Bottom 0.61: C6.2 87,23.5 v88.27,22.23 | JP1.9 v88.27,37.47 81.92,37.47 | v52.07,26.67 59.05,26.67 59.69,27.3 67.94,27.3 69.22,26.04 IC3.22 | 62.87,50.8 64.77,52.7 64.77,55.68 S5.1 66.04,58.06 R14.1
  Bottom 1.016: U$3.3 51.22,83.82 55.24,83.82 | 55.24,83.82 55.88,83.82 | 55.88,83.82 C3.- | X2.1 55.28,83.86 55.88,83.82 | 55.24,83.82 R5.2 55.24,73.03 IC1.4 55.88,70.48 56.52,69.85 64.77,69.85 | C23.1 57.78,54.1 C22.- 58.55,51.31 59.05,50.8 | 59.05,50.8 62.87,50.8 | R14.1 66.04,68.58 64.77,69.85 | C4.- 88.9,82.04 | 88.9,82.04 85.22,82.04 C11.1 81.92,83.82 76.83,83.82 73.03,80.01 73.03,72.39 70.48,69.85 64.77,69.85 | 59.05,50.8 53.98,50.8 52.07,48.9 52.07,45.72 50.8,44.45 | 50.8,44.45 46.35,44.45 40.64,50.16 33.02,50.16 29.21,53.98 17.78,53.98 11.75,47.94 | 11.75,47.94 8.89,45.09 IC2.GND 8.89,40.64 4.76,36.51 | 11.75,47.94 11.75,47.31 15.88,43.18 D60.K D2.K 22.86,34.29 22.86,31.75 | 22.86,31.75 23.5,31.11 T1.E 26.95,30.2 S2.1 | C1.- C27.- 5.21,36.07 4.76,36.51 | 4.76,36.51 C24.1 | IC3.8 53.98,23.5 C2.1 | 22.86,31.75 22.86,23.93 S1.1 20.32,21.39 20.32,5.71 22.23,3.81 26.67,3.81 | C2.1 50.16,24.77 50.16,12.06 | 50.16,12.06 50.8,11.43 C8.1 | 50.16,12.06 50.16,8.89 SW3.1 48.9,6.99 | 48.9,6.99 SW3.2 47.62,3.81 26.67,3.81 | J1.5 50.8,42.55 50.8,44.45 | 32.38,18.21 S3.1 31.47,18.14 26.67,13.34 26.67,3.81 | JP1.5 95.25,47.62 95.89,46.99 95.89,42.55 JP1.7 JP1.8 JP1.9 JP1.10 95.25,34.92 95.89,34.29 95.89,19.68 JP1.16 | V1.13 81.92,36.2 81.92,37.47 81.92,46.35 V1.8 SW2.1 SW2.2 86.36,57.78 89.53,57.78 | 89.53,57.78 JP1.1 | 88.9,82.04 88.9,71.12 C20.2 89.53,67.94 89.53,57.78 | S4.1 41.83,26.59 v41.91,26.67 | v52.07,26.67 52.07,25.4 C2.1 | X5.1 48.9,6.99 | C7.2 IC3.22 | J2.6 83.82,22.23 C6.2
INV_COM
  Bottom 1.016: K1.C 36.83,53.34 39.37,55.88 39.37,92.03 X1.1
INV_START
  Bottom 1.016: X1.2 46.31,92.03 42.55,88.27 42.55,53.48 K1.NO
N$1
  Bottom 1.016: IC3.9 57.78,20.95 Q2.2 56.52,19.68 C2.2
N$2
  Bottom 1.016: R2.1 13.97,24.13 19.68,29.84 19.68,34.92 D2.A
N$3
  Bottom 1.016: R4.1 60.33,79.38 | 60.33,79.38 59.05,79.38 58.42,78.74 IC1.3 | C3.+ 60.33,83.69 60.33,79.38
N$4
  Bottom 1.016: IC3.10 60.33,18.41 Q2.1 55.88,16.51 C8.2
N$5
  Bottom 1.016: D3.A R2.2 12.7,32.38 | 12.7,32.38 9.53,35.56 C24.2 11.43,38.73 IC2.OUT | C27.+ 12.57,32.38 12.7,32.38
N$6
  Bottom 1.016: F1.2A 8.89,74.3 13.77,79.17 U$3.2
N$7
  Bottom 1.016: IC1.2 60.96,76.2 R5.1 67.94,76.2 67.94,83.19 | 67.94,83.19 R6.2 | C5.1 70.48,83.82 69.85,83.19 67.94,83.19
N$11
  Bottom 1.016: 32.38,47.62 C9.2 21.59,51.44 D8.A | 32.38,47.62 32.67,47.34 K1.1 | 32.38,47.62 32.38,43.18 LD3.K 27.94,38.1 T1.C
N$12
  Bottom 1.016: R3.2 37.14,41.27 29.52,33.66 T1.B
N$14
  Bottom 1.016: LD3.A 24.77,48.9 R16.1
N$62
  Bottom 1.016: R14.2 76.2,67.31 SG1.-
N$74
  Bottom 1.016: D60.A 17.78,46.35 R42.1
RS
  Bottom 1.016: JP1.4 90.81,50.16 88.27,47.62 88.27,44.98 87.1,43.81 V1.7
SPEED_V
  Bottom 1.016: IC1.1 64.77,73.66 69.85,73.66 70.48,74.3 70.48,80.64 73.03,83.19 73.03,90.81 C5.2 67.94,93.34 R6.1 64.77,93.98 X2.2
UNO_REST  (1 unrouted)
  Bottom 0.61: J1.2 56.52,42.27 56.52,40.64 62.23,40.64 IC3.1 | S5.3 66.6,49.17 64.77,47.35 R1.1
  Bottom 1.016: IC3.1 62.23,46.35 R1.1
VEE  (via drill 0.7 pad 1.3)
  Top 0.61: v95.89,62.87 v95.89,52.7
  Bottom 0.61: C4.+ 95.25,82.42 95.25,74.93 93.34,73.03 93.34,65.41 v95.89,62.87 | v95.89,52.7 JP1.3
  Bottom 1.016: R11.1 81.92,86.36 C11.2 85.22,85.6 C4.+